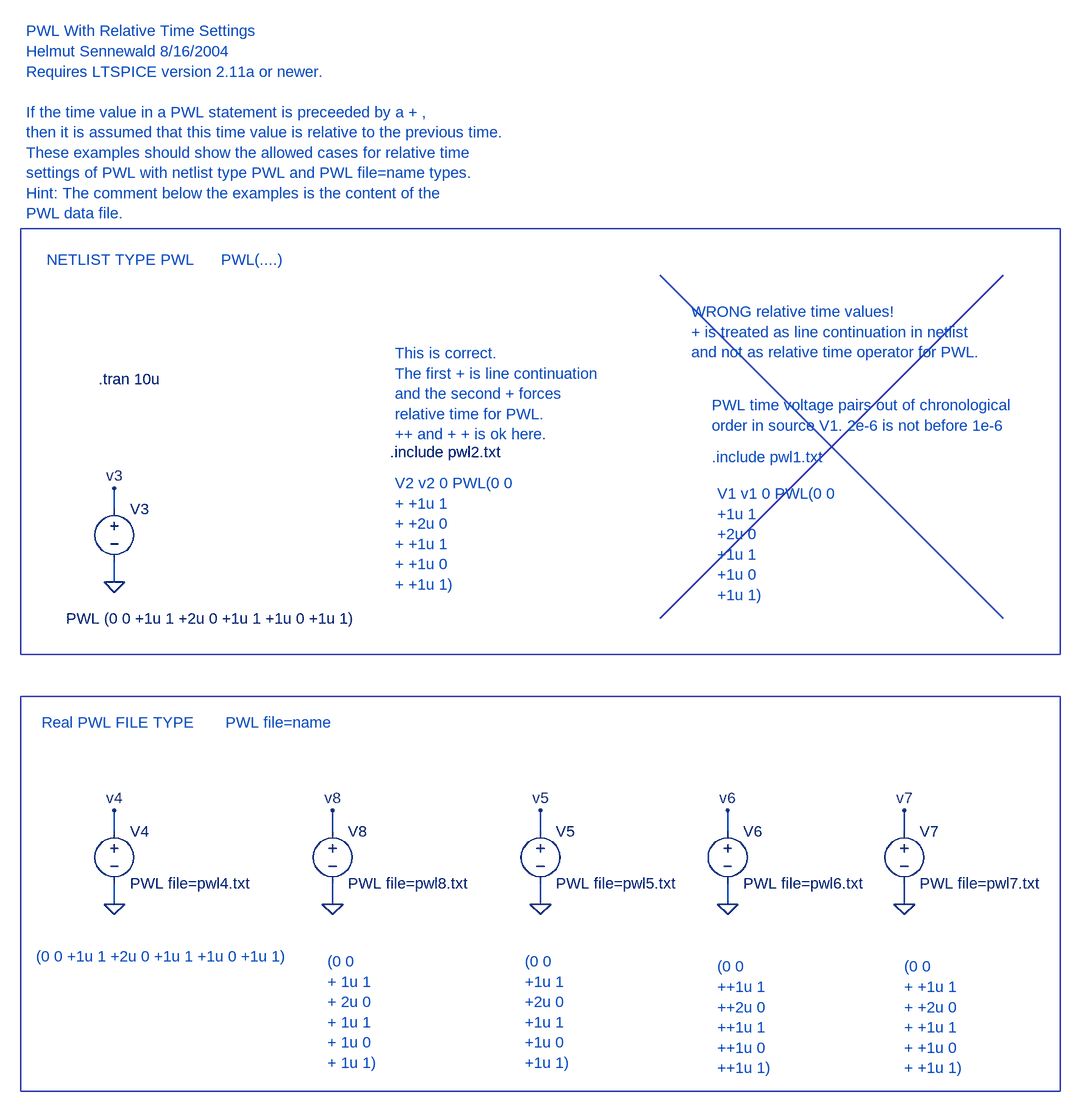
[diagram p0: schematic PWL_TEST_REL.asc]
PWL_TEST_REL.asc, the LTspice schematic file:
Version 4
SHEET 1 1696 1164
WIRE 48 592 48 560
WIRE 48 480 48 448
WIRE 48 96 48 64
WIRE 48 -16 48 -48
WIRE 704 592 704 560
WIRE 704 480 704 448
WIRE 992 592 992 560
WIRE 992 480 992 448
WIRE 1264 592 1264 560
WIRE 1264 480 1264 448
WIRE 384 592 384 560
WIRE 384 480 384 448
FLAG 48 592 0
FLAG 48 448 v4
FLAG 48 96 0
FLAG 48 -48 v3
FLAG 704 592 0
FLAG 704 448 v5
FLAG 992 592 0
FLAG 992 448 v6
FLAG 1264 592 0
FLAG 1264 448 v7
FLAG 384 592 0
FLAG 384 448 v8
SYMBOL voltage 48 464 R0
SYMATTR InstName V4
SYMATTR Value PWL file=pwl4.txt
SYMBOL voltage 48 -32 R0
WINDOW 3 -74 184 Left 0
SYMATTR Value PWL (0 0 +1u 1 +2u 0 +1u 1 +1u 0 +1u 1)
SYMATTR InstName V3
SYMBOL voltage 704 464 R0
SYMATTR InstName V5
SYMATTR Value PWL file=pwl5.txt
SYMBOL voltage 992 464 R0
SYMATTR InstName V6
SYMATTR Value PWL file=pwl6.txt
SYMBOL voltage 1264 464 R0
SYMATTR InstName V7
SYMATTR Value PWL file=pwl7.txt
SYMBOL voltage 384 464 R0
SYMATTR InstName V8
SYMATTR Value PWL file=pwl8.txt
TEXT 24 -216 Left 0 !.tran 10u
TEXT 1264 688 Left 0 ;(0 0 \n+ +1u 1 \n+ +2u 0 \n+ +1u 1 \n+ +1u 0 \n+ +1u 1)
TEXT 376 680 Left 0 ;(0 0 \n+ 1u 1 \n+ 2u 0 \n+ 1u 1 \n+ 1u 0 \n+ 1u 1)
TEXT -72 672 Left 0 ;(0 0 +1u 1 +2u 0 +1u 1 +1u 0 +1u 1)
TEXT 680 680 Left 0 ;(0 0 \n+1u 1 \n+2u 0 \n+1u 1 \n+1u 0 \n+1u 1)
TEXT 976 688 Left 0 ;(0 0 \n++1u 1 \n++2u 0 \n++1u 1 \n++1u 0 \n++1u 1)
TEXT 968 -96 Left 0 ;.include pwl1.txt
TEXT 976 -40 Left 0 ;V1 v1 0 PWL(0 0 \n+1u 1 \n+2u 0 \n+1u 1 \n+1u 0 \n+1u 1)
TEXT -88 -752 Left 0 ;PWL With Relative Time Settings\nHelmut Sennewald 8/16/2004\nRequires LTSPICE version 2.11a or newer.\n \nIf the time value in a PWL statement is preceeded by a + , \nthen it is assumed that this time value is relative to the previous time.\nThese examples should show the allowed cases for relative time\nsettings of PWL with netlist type PWL and PWL file=name types.\nHint: The comment below the examples is the content of the \nPWL data file.
TEXT 472 -104 Left 0 !.include pwl2.txt
TEXT 480 -56 Left 0 ;V2 v2 0 PWL(0 0 \n+ +1u 1 \n+ +2u 0 \n+ +1u 1 \n+ +1u 0 \n+ +1u 1)
TEXT 968 -176 Left 0 ;PWL time voltage pairs out of chronological\norder in source V1. 2e-6 is not before 1e-6
TEXT 936 -320 Left 0 ;WRONG relative time values!\n+ is treated as line continuation in netlist\nand not as relative time operator for PWL.
TEXT 480 -256 Left 0 ;This is correct.\nThe first + is line continuation \nand the second + forces\nrelative time for PWL.\n++ and + + is ok here.
TEXT -56 -400 Left 0 ;NETLIST TYPE PWL      PWL(....)
TEXT -64 312 Left 0 ;Real PWL FILE TYPE       PWL file=name
LINE Normal 1416 -376 888 152
LINE Normal 1416 152 888 -376
RECTANGLE Normal 1504 208 -96 -448
RECTANGLE Normal 1504 880 -96 272

The netlist it stands for:
* PWL_TEST_REL.asc
V4 v4 0 PWL file=pwl4.txt
V3 v3 0 PWL (0 0 +1u 1 +2u 0 +1u 1 +1u 0 +1u 1)
V5 v5 0 PWL file=pwl5.txt
V6 v6 0 PWL file=pwl6.txt
V7 v7 0 PWL file=pwl7.txt
V8 v8 0 PWL file=pwl8.txt
.tran 10u
* (0 0
* + +1u 1
* + +2u 0
* + +1u 1
* + +1u 0
* + +1u 1)
* (0 0
* + 1u 1
* + 2u 0
* + 1u 1
* + 1u 0
* + 1u 1)
* (0 0 +1u 1 +2u 0 +1u 1 +1u 0 +1u 1)
* (0 0
* +1u 1
* +2u 0
* +1u 1
* +1u 0
* +1u 1)
* (0 0
* ++1u 1
* ++2u 0
* ++1u 1
* ++1u 0
* ++1u 1)
* .include pwl1.txt
* V1 v1 0 PWL(0 0
* +1u 1
* +2u 0
* +1u 1
* +1u 0
* +1u 1)
* PWL With Relative Time Settings
* Helmut Sennewald 8/16/2004
* Requires LTSPICE version 2.11a or newer.
* If the time value in a PWL statement is preceeded by a + ,
* then it is assumed that this time value is relative to the previous time.
* These examples should show the allowed cases for relative time
* settings of PWL with netlist type PWL and PWL file=name types.
* Hint: The comment below the examples is the content of the
* PWL data file.
.include pwl2.txt
* V2 v2 0 PWL(0 0
* + +1u 1
* + +2u 0
* + +1u 1
* + +1u 0
* + +1u 1)
* PWL time voltage pairs out of chronological
* order in source V1. 2e-6 is not before 1e-6
* WRONG relative time values!
* + is treated as line continuation in netlist
* and not as relative time operator for PWL.
* This is correct.
* The first + is line continuation
* and the second + forces
* relative time for PWL.
* ++ and + + is ok here.
* NETLIST TYPE PWL      PWL(....)
* Real PWL FILE TYPE       PWL file=name
.backanno
.end